# EAGLE schematic GPNode (EAGLE 6.4)

## Sheet 1 of 5
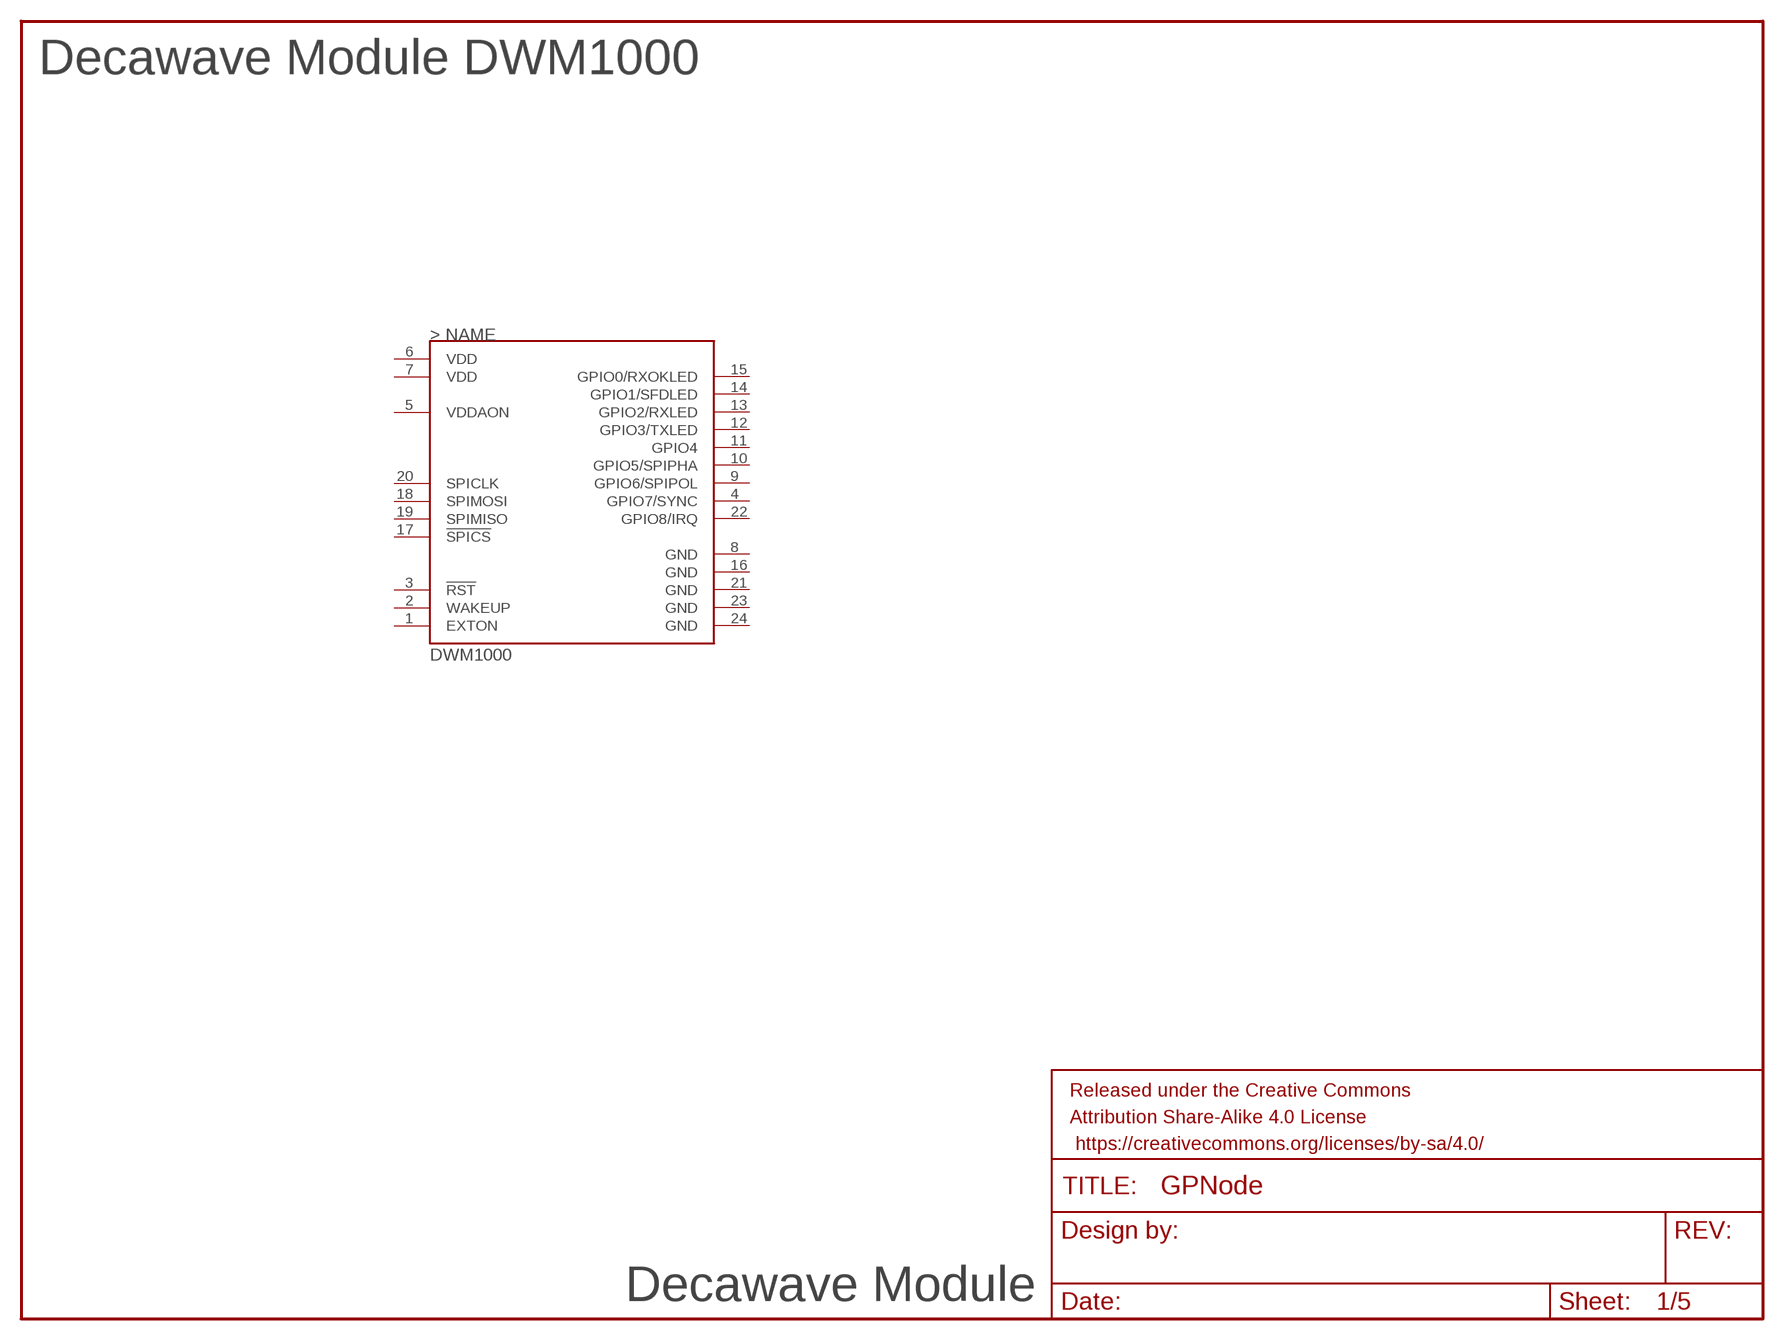
[diagram p0: schematic, sheet 1]

### Parts
FRAME1  FRAME-LETTERNO_PACKAGE  [DUMMY]
U$1  DWM1000  [DWM1000]
Unconnected: U$1.1(EXTON) U$1.2(WAKEUP) U$1.3(!RST) U$1.4(GPIO7/SYNC) U$1.9(GPIO6/SPIPOL) U$1.10(GPIO5/SPIPHA) U$1.11(GPIO4) U$1.12(GPIO3/TXLED) U$1.13(GPIO2/RXLED) U$1.14(GPIO1/SFDLED) U$1.15(GPIO0/RXOKLED) U$1.17(!SPICS) U$1.18(SPIMOSI) U$1.19(SPIMISO) U$1.20(SPICLK) U$1.22(GPIO8/IRQ)

### Notes on the sheet
- Decawave Module DWM1000
- Decawave Module

## Sheet 2 of 5
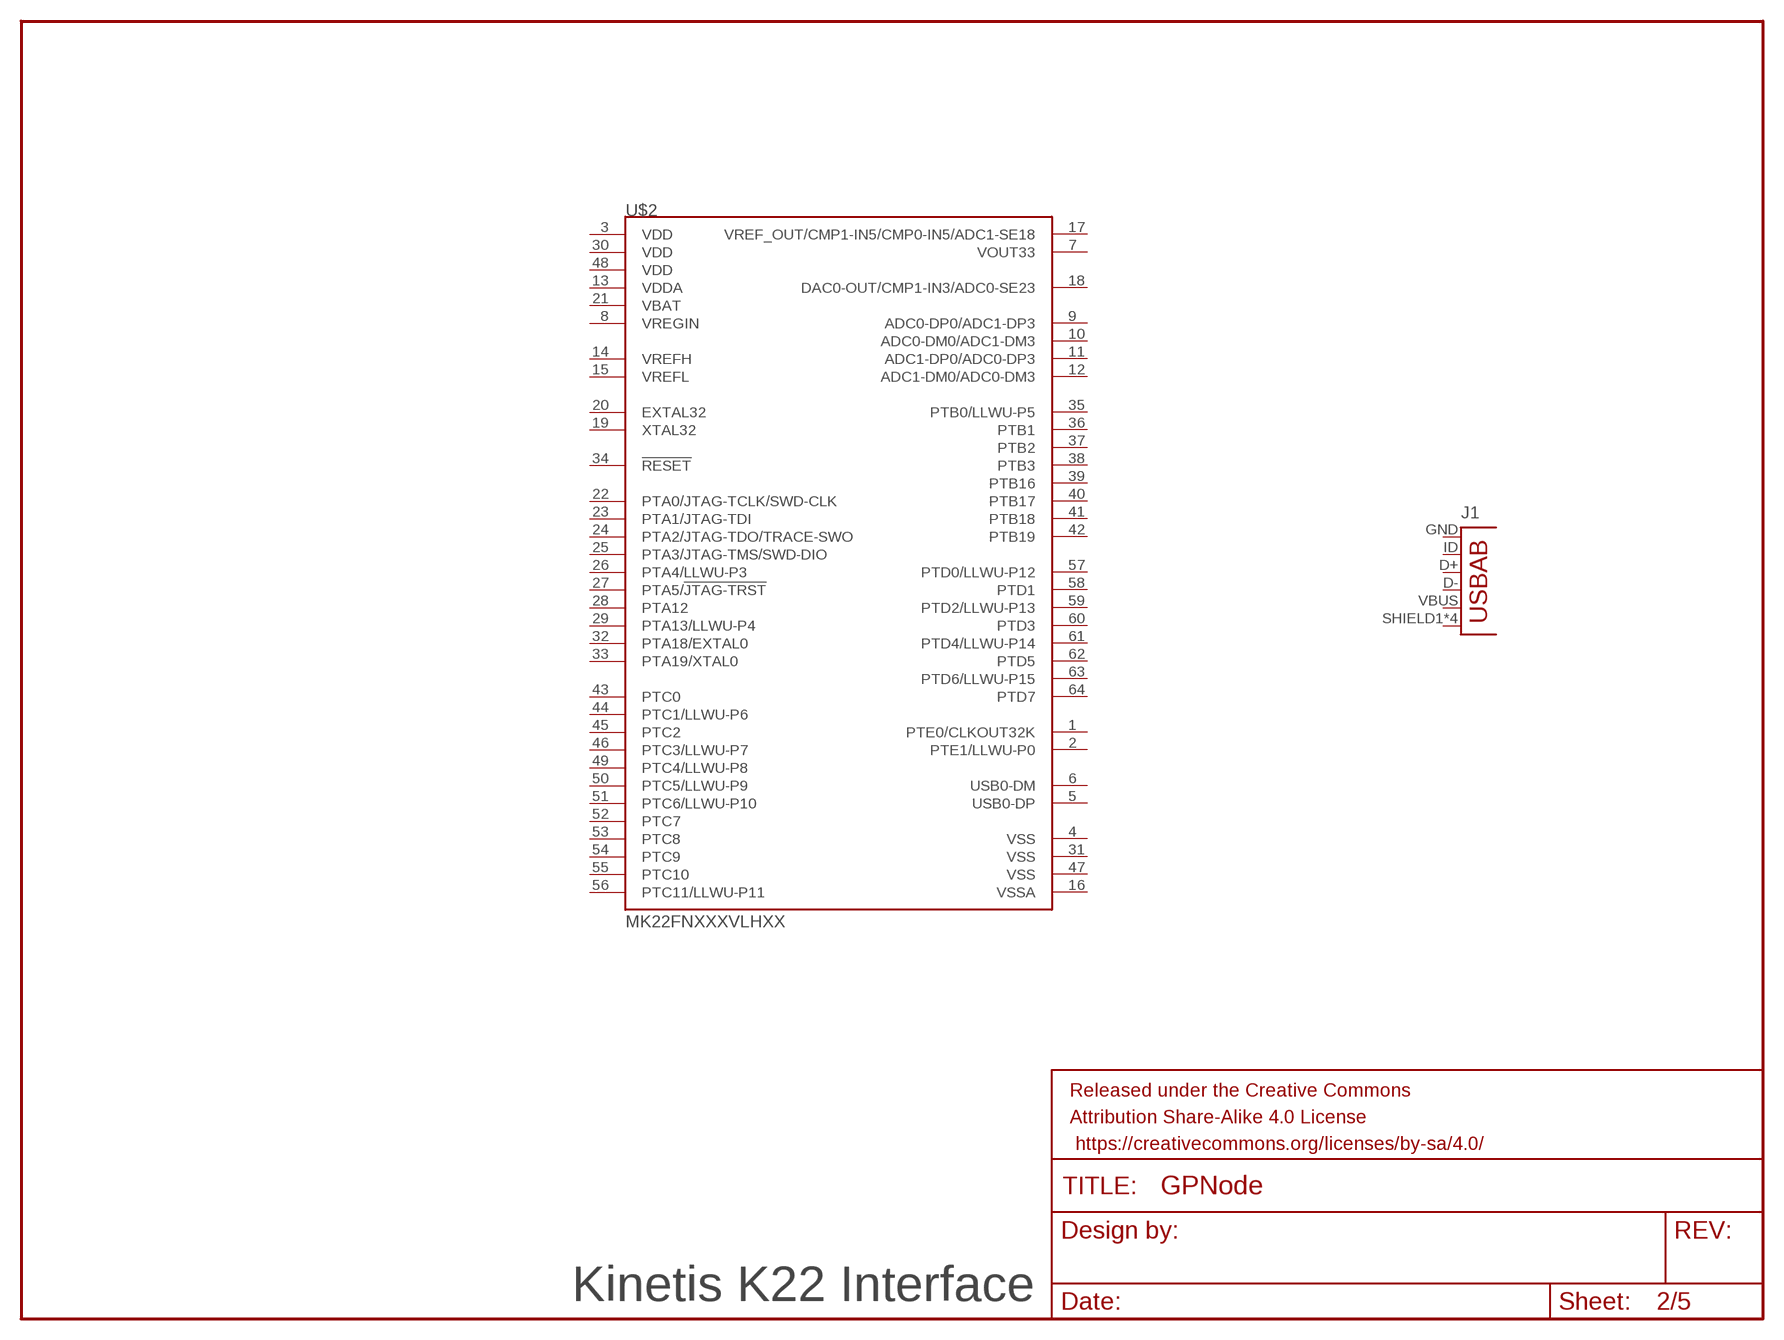
[diagram p1: schematic, sheet 2]

### Parts
FRAME2  FRAME-LETTERNO_PACKAGE  [DUMMY]
J1  USB-AB  [USB-AB-MICRO-SMD]
U$2  MK22FNXXXVLHXX  [TQFP64]
Unconnected: J1.D+ J1.D- J1.GND J1.ID(USBID) J1.SHIELD1(SHIELD) J1.SHIELD2(SHIELD) J1.SHIELD3(SHIELD) J1.SHIELD4(SHIELD) J1.VBUS U$2.1(PTE0/CLKOUT32K) U$2.2(PTE1/LLWU-P0) U$2.5(USB0-DP) U$2.6(USB0-DM) U$2.7(VOUT33) U$2.9(ADC0-DP0/ADC1-DP3) U$2.10(ADC0-DM0/ADC1-DM3) U$2.11(ADC1-DP0/ADC0-DP3) U$2.12(ADC1-DM0/ADC0-DM3) U$2.14(VREFH) U$2.15(VREFL) U$2.17(VREF_OUT/CMP1-IN5/CMP0-IN5/ADC1-SE18) U$2.18(DAC0-OUT/CMP1-IN3/ADC0-SE23) U$2.19(XTAL32) U$2.20(EXTAL32) U$2.22(PTA0/JTAG-TCLK/SWD-CLK) U$2.23(PTA1/JTAG-TDI) U$2.24(PTA2/JTAG-TDO/TRACE-SWO) U$2.25(PTA3/JTAG-TMS/SWD-DIO) U$2.26(PTA4/LLWU-P3) U$2.27(PTA5/!JTAG-TRST) U$2.28(PTA12) U$2.29(PTA13/LLWU-P4) U$2.32(PTA18/EXTAL0) U$2.33(PTA19/XTAL0) U$2.34(!RESET) U$2.35(PTB0/LLWU-P5) U$2.36(PTB1) U$2.37(PTB2) U$2.38(PTB3) U$2.39(PTB16) U$2.40(PTB17) U$2.41(PTB18) U$2.42(PTB19) U$2.43(PTC0) U$2.44(PTC1/LLWU-P6) U$2.45(PTC2) U$2.46(PTC3/LLWU-P7) U$2.49(PTC4/LLWU-P8) U$2.50(PTC5/LLWU-P9) U$2.51(PTC6/LLWU-P10) U$2.52(PTC7) U$2.53(PTC8) U$2.54(PTC9) U$2.55(PTC10) U$2.56(PTC11/LLWU-P11) U$2.57(PTD0/LLWU-P12) U$2.58(PTD1) U$2.59(PTD2/LLWU-P13) U$2.60(PTD3) U$2.61(PTD4/LLWU-P14) U$2.62(PTD5) U$2.63(PTD6/LLWU-P15) U$2.64(PTD7)

### Notes on the sheet
- Kinetis K22 Interface

## Sheet 3 of 5
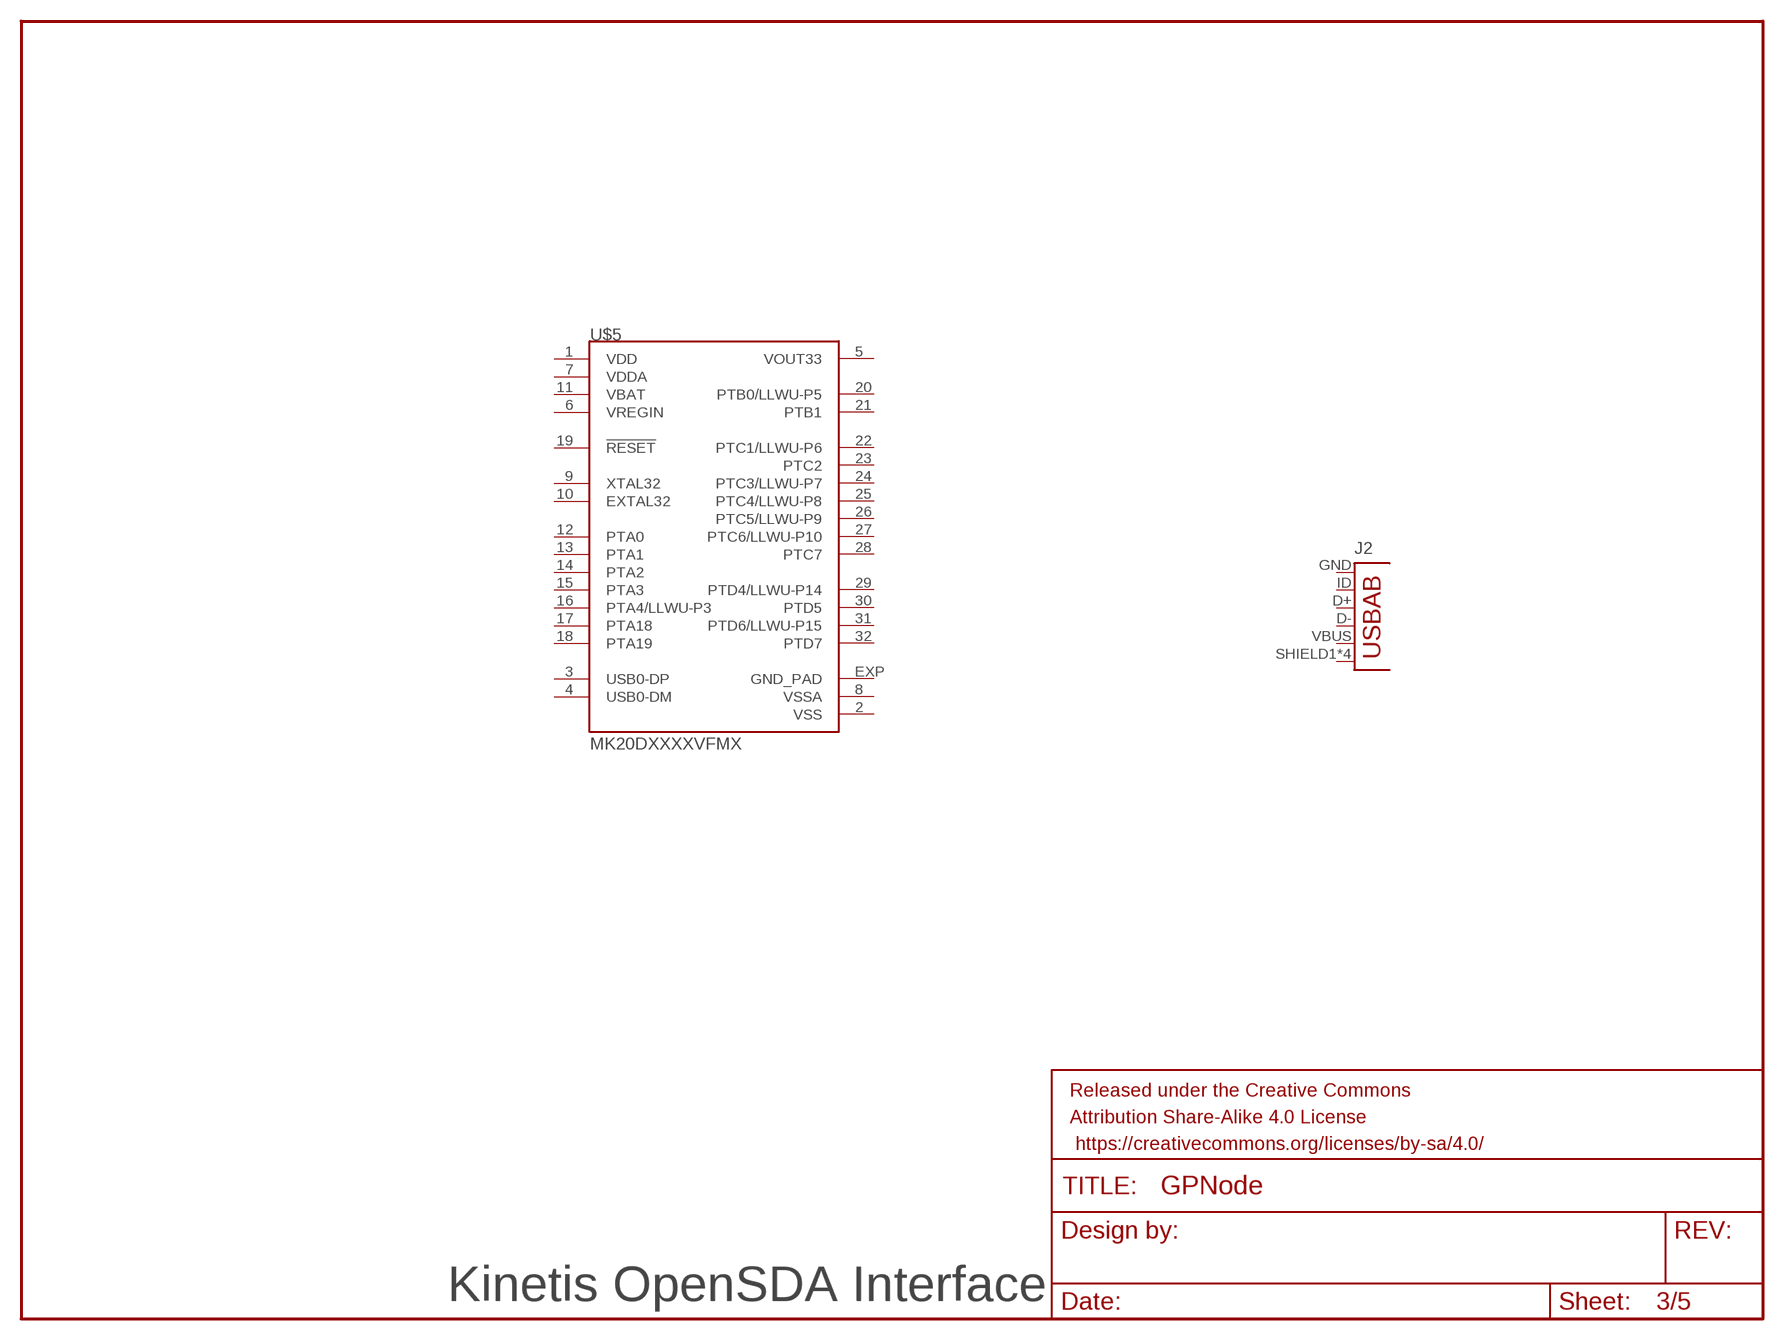
[diagram p2: schematic, sheet 3]

### Parts
FRAME3  FRAME-LETTERNO_PACKAGE  [DUMMY]
J2  USB-AB  [USB-AB-MICRO-SMD]
U$5  MK20DXXXXVFMX  [QFN32]
Unconnected: J2.D+ J2.D- J2.GND J2.ID(USBID) J2.SHIELD1(SHIELD) J2.SHIELD2(SHIELD) J2.SHIELD3(SHIELD) J2.SHIELD4(SHIELD) J2.VBUS U$5.3(USB0-DP) U$5.4(USB0-DM) U$5.9(XTAL32) U$5.10(EXTAL32) U$5.12(PTA0) U$5.13(PTA1) U$5.14(PTA2) U$5.15(PTA3) U$5.16(PTA4/LLWU-P3) U$5.17(PTA18) U$5.18(PTA19) U$5.19(!RESET) U$5.20(PTB0/LLWU-P5) U$5.21(PTB1) U$5.22(PTC1/LLWU-P6) U$5.23(PTC2) U$5.24(PTC3/LLWU-P7) U$5.25(PTC4/LLWU-P8) U$5.26(PTC5/LLWU-P9) U$5.27(PTC6/LLWU-P10) U$5.28(PTC7) U$5.29(PTD4/LLWU-P14) U$5.30(PTD5) U$5.31(PTD6/LLWU-P15) U$5.32(PTD7)

### Notes on the sheet
- Kinetis OpenSDA Interface

## Sheet 4 of 5
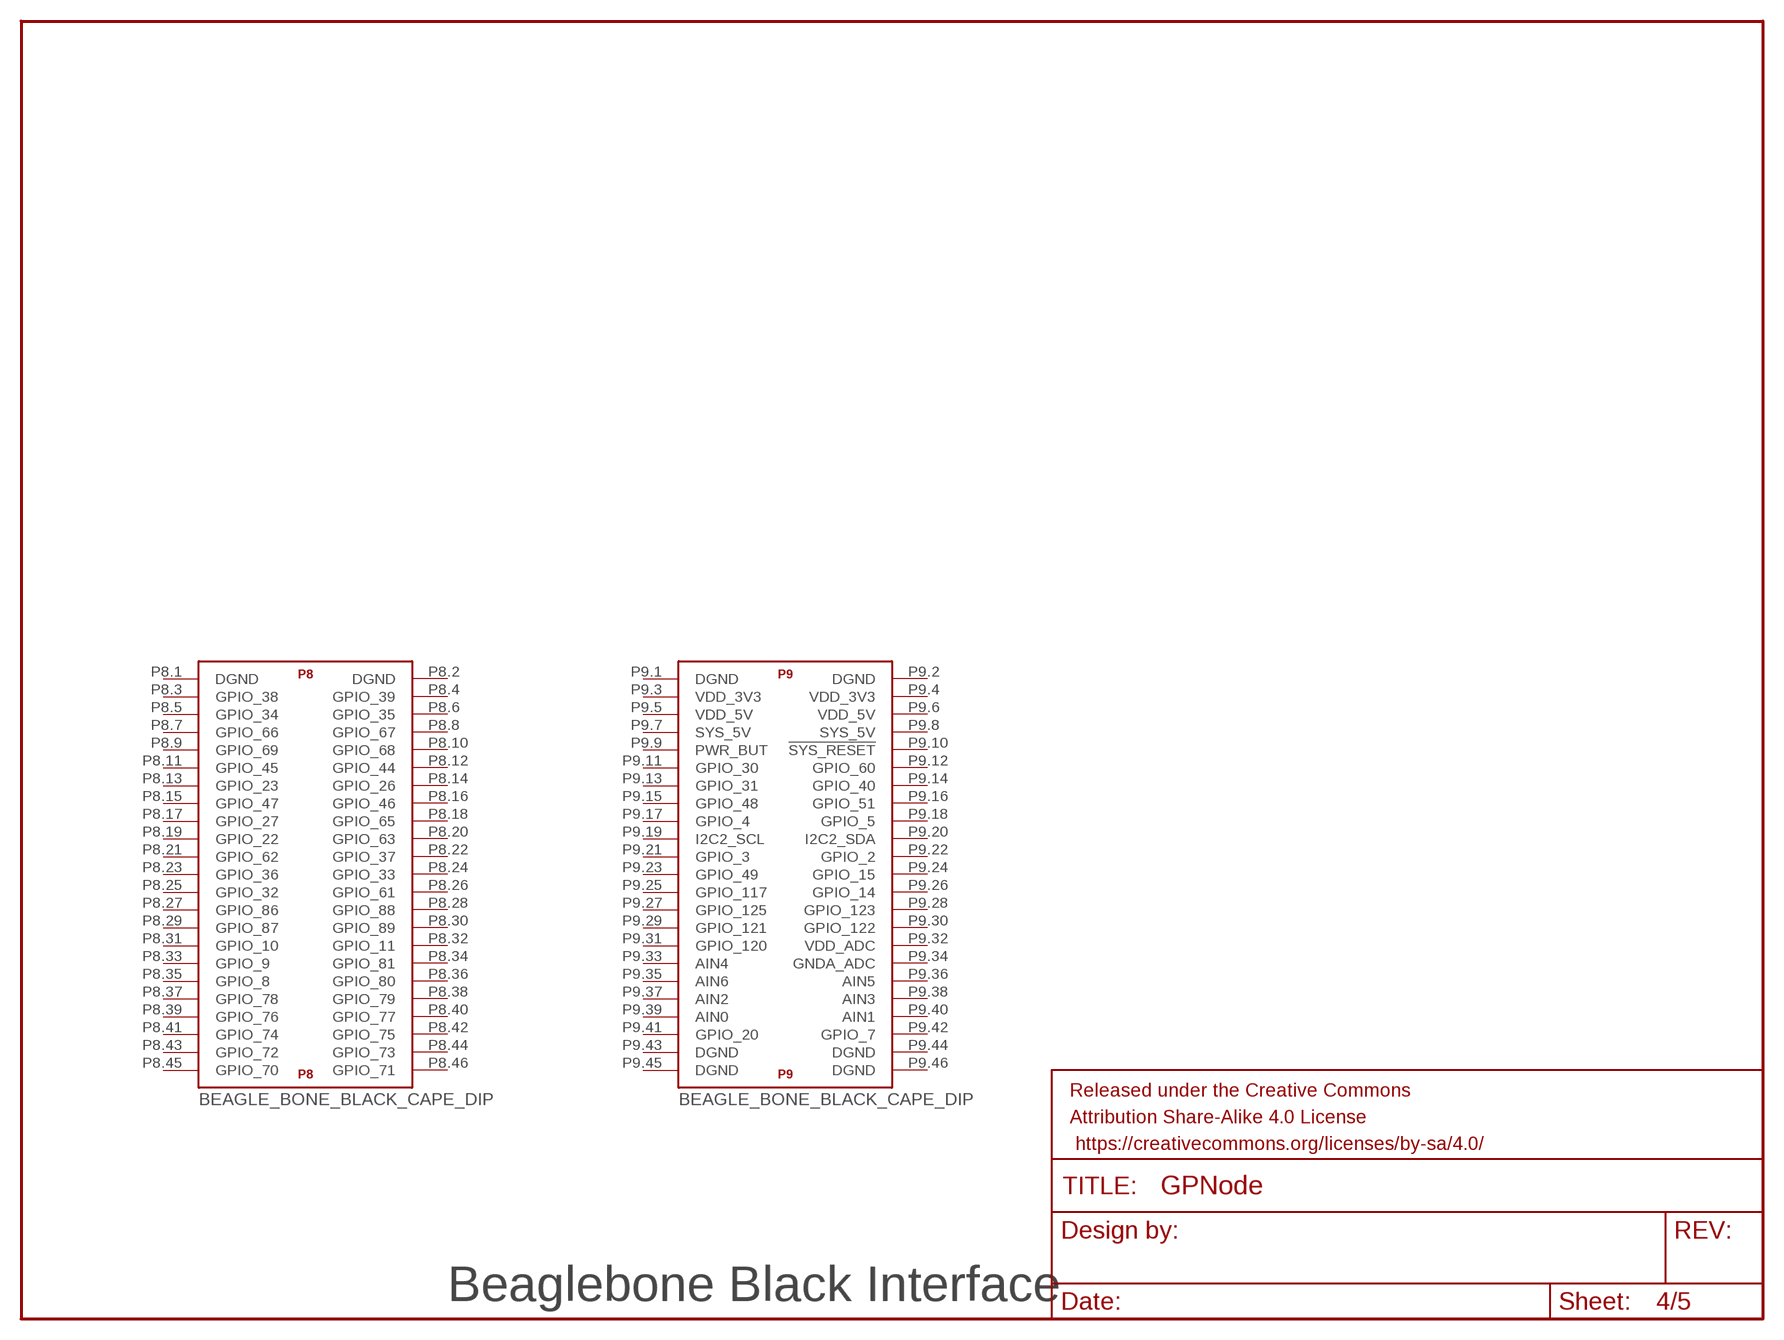
[diagram p3: schematic, sheet 4]

### Parts
FRAME4  FRAME-LETTERNO_PACKAGE  [DUMMY]
U$4  BEAGLE_BONE_BLACK_CAPE_DIP  [BEAGLE_BONE_BLACK_CAPE]
Unconnected: U$4.P8.3(P8:GPIO_38) U$4.P8.4(P8:GPIO_39) U$4.P8.5(P8:GPIO_34) U$4.P8.6(P8:GPIO_35) U$4.P8.7(P8:GPIO_66) U$4.P8.8(P8:GPIO_67) U$4.P8.9(P8:GPIO_69) U$4.P8.10(P8:GPIO_68) U$4.P8.11(P8:GPIO_45) U$4.P8.12(P8:GPIO_44) U$4.P8.13(P8:GPIO_23) U$4.P8.14(P8:GPIO_26) U$4.P8.15(P8:GPIO_47) U$4.P8.16(P8:GPIO_46) U$4.P8.17(P8:GPIO_27) U$4.P8.18(P8:GPIO_65) U$4.P8.19(P8:GPIO_22) U$4.P8.20(P8:GPIO_63) U$4.P8.21(P8:GPIO_62) U$4.P8.22(P8:GPIO_37) U$4.P8.23(P8:GPIO_36) U$4.P8.24(P8:GPIO_33) U$4.P8.25(P8:GPIO_32) U$4.P8.26(P8:GPIO_61) U$4.P8.27(P8:GPIO_86) U$4.P8.28(P8:GPIO_88) U$4.P8.29(P8:GPIO_87) U$4.P8.30(P8:GPIO_89) U$4.P8.31(P8:GPIO_10) U$4.P8.32(P8:GPIO_11) U$4.P8.33(P8:GPIO_9) U$4.P8.34(P8:GPIO_81) U$4.P8.35(P8:GPIO_8) U$4.P8.36(P8:GPIO_80) U$4.P8.37(P8:GPIO_78) U$4.P8.38(P8:GPIO_79) U$4.P8.39(P8:GPIO_76) U$4.P8.40(P8:GPIO_77) U$4.P8.41(P8:GPIO_74) U$4.P8.42(P8:GPIO_75) U$4.P8.43(P8:GPIO_72) U$4.P8.44(P8:GPIO_73) U$4.P8.45(P8:GPIO_70) U$4.P8.46(P8:GPIO_71) U$4.P9.8(P9:SYS_5V) U$4.P9.9(P9:PWR_BUT) U$4.P9.10(P9:!SYS_RESET) U$4.P9.11(P9:GPIO_30) U$4.P9.12(P9:GPIO_60) U$4.P9.13(P9:GPIO_31) U$4.P9.14(P9:GPIO_40) U$4.P9.15(P9:GPIO_48) U$4.P9.16(P9:GPIO_51) U$4.P9.17(P9:GPIO_4) U$4.P9.18(P9:GPIO_5) U$4.P9.19(P9:I2C2_SCL) U$4.P9.20(P9:I2C2_SDA) U$4.P9.21(P9:GPIO_3) U$4.P9.22(P9:GPIO_2) U$4.P9.23(P9:GPIO_49) U$4.P9.24(P9:GPIO_15) U$4.P9.25(P9:GPIO_117) U$4.P9.26(P9:GPIO_14) U$4.P9.27(P9:GPIO_125) U$4.P9.28(P9:GPIO_123) U$4.P9.29(P9:GPIO_121) U$4.P9.30(P9:GPIO_122) U$4.P9.31(P9:GPIO_120) U$4.P9.33(P9:AIN4) U$4.P9.35(P9:AIN6) U$4.P9.36(P9:AIN5) U$4.P9.37(P9:AIN2) U$4.P9.38(P9:AIN3) U$4.P9.39(P9:AIN0) U$4.P9.40(P9:AIN1) U$4.P9.41(P9:GPIO_20) U$4.P9.42(P9:GPIO_7)

### Notes on the sheet
- Beaglebone Black Interface

## Sheet 5 of 5
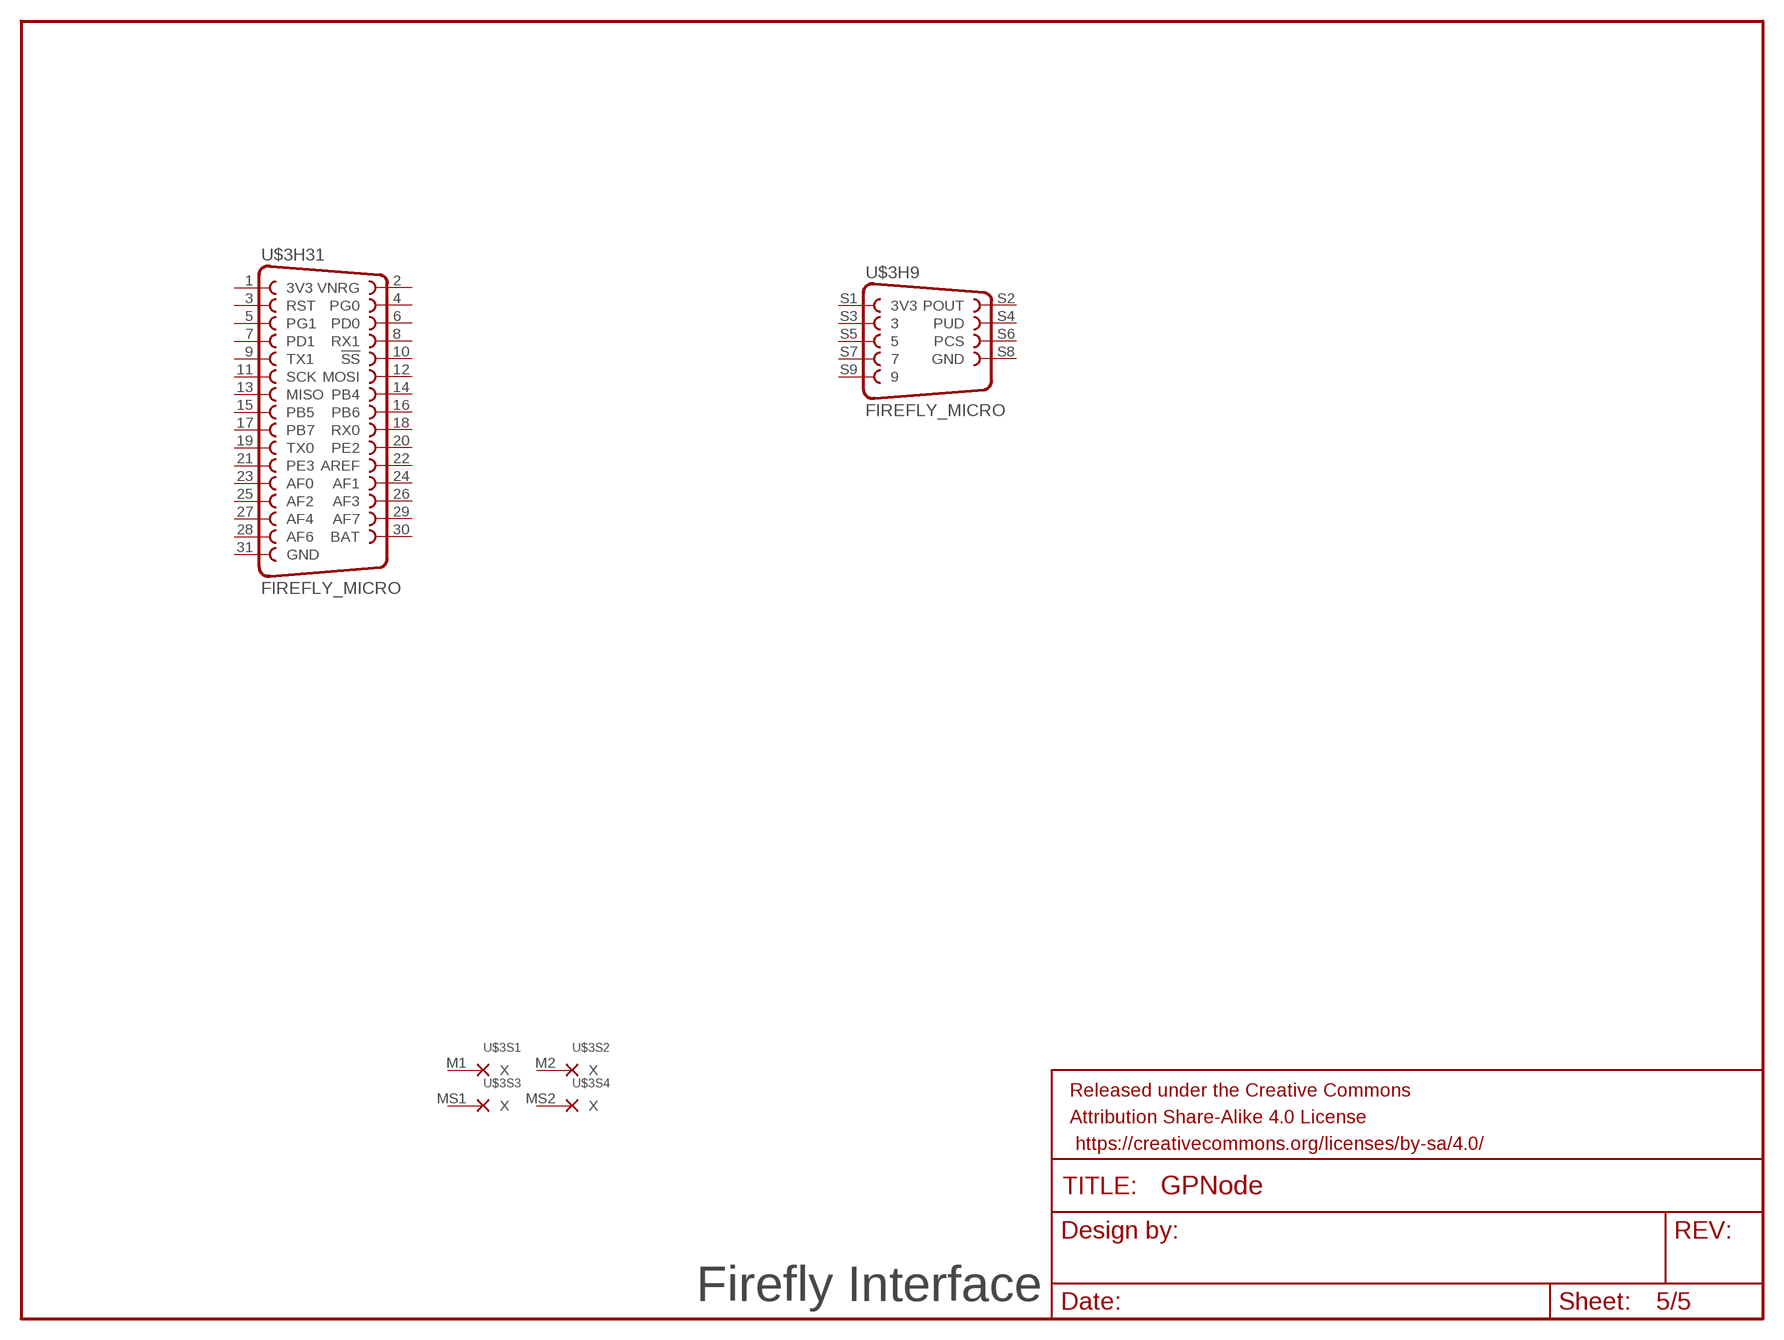
[diagram p4: schematic, sheet 5]

### Parts
FRAME5  FRAME-LETTERNO_PACKAGE  [DUMMY]
U$3  FIREFLY_MICRO  [FIREFLY_MICRO]
Unconnected: U$3.3(H31:RST) U$3.4(H31:PG0) U$3.5(H31:PG1) U$3.6(H31:PD0) U$3.7(H31:PD1) U$3.8(H31:RX1) U$3.9(H31:TX1) U$3.10(H31:!SS) U$3.11(H31:SCK) U$3.12(H31:MOSI) U$3.13(H31:MISO) U$3.14(H31:PB4) U$3.15(H31:PB5) U$3.16(H31:PB6) U$3.17(H31:PB7) U$3.18(H31:RX0) U$3.19(H31:TX0) U$3.20(H31:PE2) U$3.21(H31:PE3) U$3.22(H31:AREF) U$3.23(H31:AF0) U$3.24(H31:AF1) U$3.25(H31:AF2) U$3.26(H31:AF3) U$3.27(H31:AF4) U$3.28(H31:AF6) U$3.29(H31:AF7) U$3.30(H31:BAT) U$3.M1(S1:X) U$3.M2(S2:X) U$3.MS1(S3:X) U$3.MS2(S4:X) U$3.S2(H9:POUT) U$3.S3 U$3.S4(H9:PUD) U$3.S5 U$3.S6(H9:PCS) U$3.S7 U$3.S9

### Notes on the sheet
- Firefly Interface

## Power pins joined to a net without a drawn wire
3V3: U$3.1(H31:3V3) U$3.S1(H9:3V3)
DGND: U$4.P8.1(P8:DGND) U$4.P8.2(P8:DGND) U$4.P9.1(P9:DGND) U$4.P9.2(P9:DGND) U$4.P9.43(P9:DGND) U$4.P9.44(P9:DGND) U$4.P9.45(P9:DGND) U$4.P9.46(P9:DGND)
GND: U$1.8(GND) U$1.16(GND) U$1.21(GND) U$1.23(GND) U$1.24(GND) U$3.31(H31:GND) U$3.S8(H9:GND)
GND_PAD: U$5.EXP(GND_PAD)
GNDA_ADC: U$4.P9.34(P9:GNDA_ADC)
SYS_5V: U$4.P9.7(P9:SYS_5V)
VBAT: U$2.21(VBAT) U$5.11(VBAT)
VDD: U$1.6(VDD) U$1.7(VDD) U$2.3(VDD) U$2.30(VDD) U$2.48(VDD) U$5.1(VDD)
VDD_3V3: U$4.P9.3(P9:VDD_3V3) U$4.P9.4(P9:VDD_3V3)
VDD_5V: U$4.P9.5(P9:VDD_5V) U$4.P9.6(P9:VDD_5V)
VDD_ADC: U$4.P9.32(P9:VDD_ADC)
VDDA: U$2.13(VDDA) U$5.7(VDDA)
VDDAON: U$1.5(VDDAON)
VNRG: U$3.2(H31:VNRG)
VOUT33: U$5.5(VOUT33)
VREGIN: U$2.8(VREGIN) U$5.6(VREGIN)
VSS: U$2.4(VSS) U$2.31(VSS) U$2.47(VSS) U$5.2(VSS)
VSSA: U$2.16(VSSA) U$5.8(VSSA)

## Library data of the parts
FRAME1-FRAME5 = SparkFun-Aesthetics:FRAME-LETTER: Schematic Frame Standard 8.5x11 US Letter frame; DESIGNER: Nobody; VERSION: v01
J1 J2 = Connectors:USB-AB: This is a USB AB connector that is compatible with USB OTG. i.e. this connector can serve as a host or device
U$1 = Decawave:DWM1000: Decawave Module DWM1000 DecaWave module with on-board chip antenna
U$2 = Freescale:MK22FNXXXV: Freescale Kinetis K22 ARM Cortex-M4 Microcontroller; PACKAGE: LQFP64
U$3 = Boards:FIREFLY: Addon Board for Firefly Sensor Nodes This version is complieant with Firefly Micro with Atmel Atmega128RFA1
U$4 = Boards:BEAGLE_BONE_BLACK_CAPE: Beaglebone Black Cape
U$5 = Freescale:MK20DXXXXV; PACKAGE: QFN32